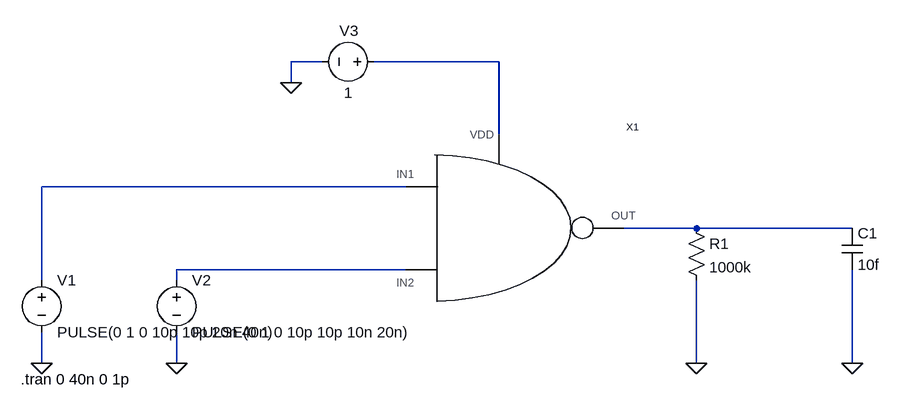
[diagram p0: schematic example_nand.asc]
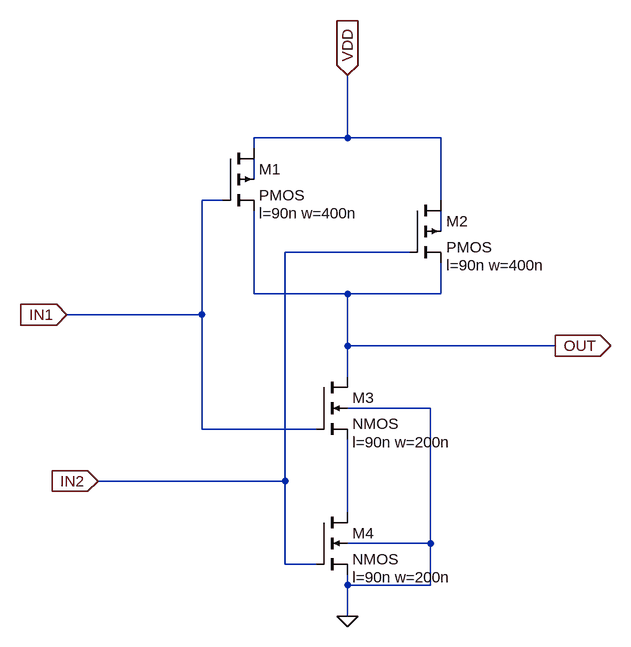
[diagram p1: sub-circuit nand.asc]
example_nand.asc, the LTspice schematic file:
Version 4
SHEET 1 1168 680
WIRE 304 -176 256 -176
WIRE 576 -176 384 -176
WIRE 256 -144 256 -176
WIRE 576 -64 576 -176
WIRE 432 16 -128 16
WIRE 880 80 768 80
WIRE 1120 80 880 80
WIRE 432 144 80 144
WIRE -128 160 -128 16
WIRE 80 160 80 144
WIRE -128 288 -128 240
WIRE 80 288 80 240
WIRE 880 288 880 160
WIRE 1120 288 1120 144
FLAG 256 -144 0
FLAG -128 288 0
FLAG 80 288 0
FLAG 880 288 0
FLAG 1120 288 0
SYMBOL voltage -128 144 R0
WINDOW 123 0 0 Left 0
WINDOW 39 0 0 Left 0
SYMATTR InstName V1
SYMATTR Value PULSE(0 1 0 10p 10p 20n 40n)
SYMBOL voltage 80 144 R0
WINDOW 123 0 0 Left 0
WINDOW 39 0 0 Left 0
SYMATTR InstName V2
SYMATTR Value PULSE(0 1 0 10p 10p 10n 20n)
SYMBOL voltage 400 -176 R90
WINDOW 0 -32 55 VBottom 2
WINDOW 3 32 56 VTop 2
WINDOW 123 0 0 Left 0
WINDOW 39 0 0 Left 0
SYMATTR InstName V3
SYMATTR Value 1
SYMBOL res 864 64 R0
SYMATTR InstName R1
SYMATTR Value 1000k
SYMBOL cap 1104 80 R0
SYMATTR InstName C1
SYMATTR Value 10f
SYMBOL nand 480 80 R0
SYMATTR InstName X1
TEXT -160 312 Left 2 !.tran 0 40n 0 1p

nand.asc, the sub-circuit schematic file:
Version 4
SHEET 1 1232 788
WIRE 448 -192 448 -288
WIRE 448 -192 304 -192
WIRE 592 -192 448 -192
WIRE 304 -176 304 -192
WIRE 304 -128 304 -160
WIRE 256 -96 224 -96
WIRE 592 -96 592 -192
WIRE 592 -48 592 -80
WIRE 544 -16 352 -16
WIRE 304 48 304 -80
WIRE 448 48 304 48
WIRE 592 48 592 0
WIRE 592 48 448 48
WIRE 224 80 224 -96
WIRE 224 80 16 80
WIRE 448 128 448 48
WIRE 768 128 448 128
WIRE 448 176 448 128
WIRE 576 224 448 224
WIRE 224 256 224 80
WIRE 400 256 224 256
WIRE 352 336 352 -16
WIRE 352 336 64 336
WIRE 448 384 448 272
WIRE 576 432 576 224
WIRE 576 432 448 432
WIRE 352 464 352 336
WIRE 400 464 352 464
WIRE 448 496 448 480
WIRE 576 496 576 432
WIRE 576 496 448 496
WIRE 448 544 448 496
FLAG 448 544 0
FLAG 768 128 OUT
IOPIN 768 128 Out
FLAG 448 -288 VDD
IOPIN 448 -288 In
FLAG 16 80 IN1
IOPIN 16 80 In
FLAG 64 336 IN2
IOPIN 64 336 In
SYMBOL pmos4 256 -176 R0
WINDOW 123 56 100 Left 2
SYMATTR Value2 l=90n w=400n
SYMATTR InstName M1
SYMBOL pmos4 544 -96 R0
WINDOW 123 56 100 Left 2
SYMATTR Value2 l=90n w=400n
SYMATTR InstName M2
SYMBOL nmos4 400 176 R0
WINDOW 123 56 100 Left 2
SYMATTR Value2 l=90n w=200n
SYMATTR InstName M3
SYMBOL nmos4 400 384 R0
WINDOW 123 56 100 Left 2
SYMATTR Value2 l=90n w=200n
SYMATTR InstName M4

The netlist it stands for:
* example_nand.asc
V1 N002 0 PULSE(0 1 0 10p 10p 20n 40n)
V2 N004 0 PULSE(0 1 0 10p 10p 10n 20n)
V3 N001 0 1
R1 N003 0 1000k
C1 N003 0 10f
XX1 N002 N004 N001 N003 nand

* block symbol definitions
.subckt nand IN1 IN2 VDD OUT
M1 VDD IN1 OUT N001 PMOS l=90n w=400n
M2 VDD IN2 OUT N002 PMOS l=90n w=400n
M3 OUT IN1 N003 0 NMOS l=90n w=200n
M4 N003 IN2 0 0 NMOS l=90n w=200n
.ends nand

.model NMOS NMOS
.model PMOS PMOS
.lib standard.mos
.tran 0 40n 0 1p
.backanno
.end